# Altium schematic sheet PowerRegulator.SchDoc
size A4
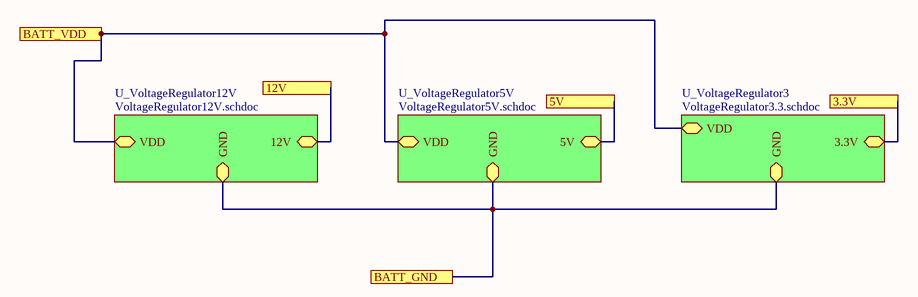
[diagram p0: PowerRegulator.SchDoc]

## Sub-sheets
U_VoltageRegulator3 = VoltageRegulator3.3.schdoc: GND, VDD, 3.3V
U_VoltageRegulator5V = VoltageRegulator5V.schdoc: GND, 5V, VDD
U_VoltageRegulator12V = VoltageRegulator12V.schdoc: GND, 12V, VDD

## Ports
3.3V, 5V, 12V, BATT_GND, BATT_VDD

## Nets
3.3V: port 3.3V, sheet U_VoltageRegulator3/3.3V
5V: port 5V, sheet U_VoltageRegulator5V/5V
12V: port 12V, sheet U_VoltageRegulator12V/12V
BATT_GND: port BATT_GND, sheet U_VoltageRegulator12V/GND, sheet U_VoltageRegulator3/GND, sheet U_VoltageRegulator5V/GND
BATT_VDD: port BATT_VDD, sheet U_VoltageRegulator12V/VDD, sheet U_VoltageRegulator3/VDD, sheet U_VoltageRegulator5V/VDD

## Notes on the sheet
- Title
- Size:
- Date:
- A4
- Number:
- Time:
- Revision:
- Sheet
- of
- File: